# Altium schematic sheet NanoBoard.SchDoc
size A4
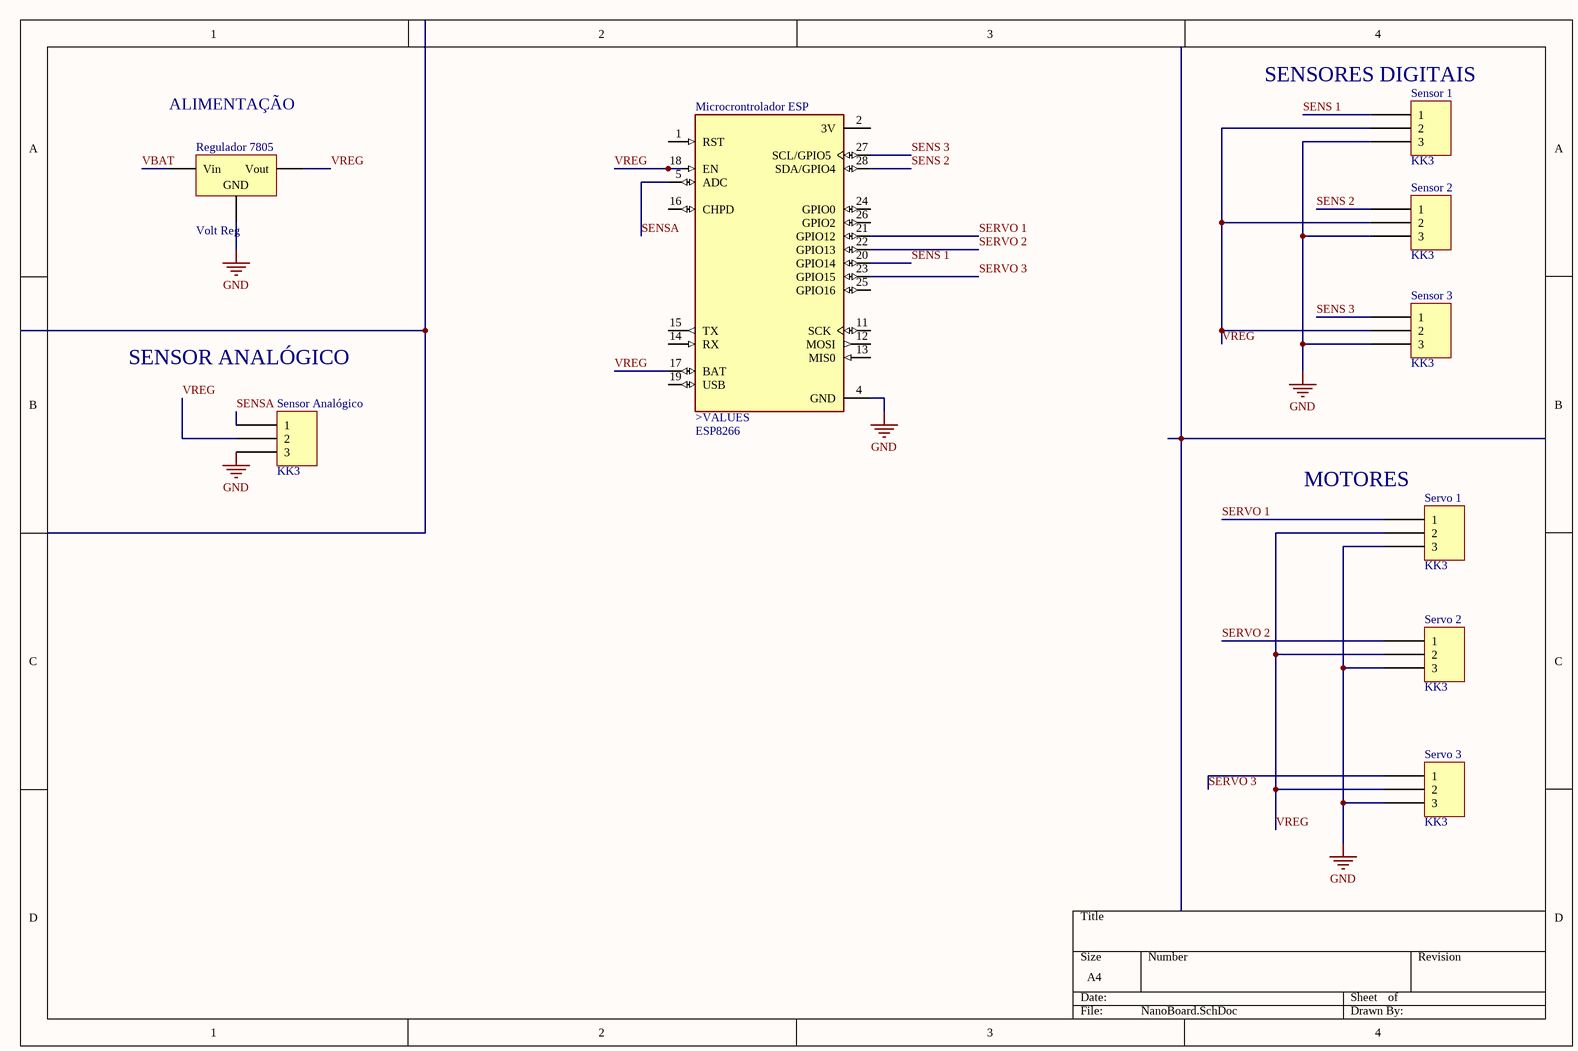
[diagram p0: NanoBoard.SchDoc]

## Parts
Microcrontrolador_ESP  ESP8266  [XCVR_ESP8266]
Regulador_7805  Volt Reg  [D2PAK_N]
Sensor_1  KK3  [KK3]
Sensor_2  KK3  [KK3]
Sensor_3  KK3  [KK3]
Sensor_Analógico  KK3  [KK3]
Servo_1  KK3  [KK3]
Servo_2  KK3  [KK3]
Servo_3  KK3  [KK3]

## Nets
GND: Microcrontrolador_ESP.4(GND) Regulador_7805.2(GND) Sensor_1.3 Sensor_2.3 Sensor_3.3 Sensor_Analógico.3 Servo_1.3 Servo_2.3 Servo_3.3
SENS 1: Microcrontrolador_ESP.20(GPIO14) Sensor_1.1
SENS 2: Microcrontrolador_ESP.28(SDA/GPIO4) Sensor_2.1
SENS 3: Microcrontrolador_ESP.27(SCL/GPIO5) Sensor_3.1
SENSA: Microcrontrolador_ESP.5(ADC) Sensor_Analógico.1
SERVO 1: Microcrontrolador_ESP.21(GPIO12) Servo_1.1
SERVO 2: Microcrontrolador_ESP.22(GPIO13) Servo_2.1
SERVO 3: Microcrontrolador_ESP.23(GPIO15) Servo_3.1
VBAT: Regulador_7805.1(Vin)
VREG: Microcrontrolador_ESP.17(BAT) Microcrontrolador_ESP.18(EN) Regulador_7805.3(Vout) Sensor_1.2 Sensor_2.2 Sensor_3.2 Sensor_Analógico.2 Servo_1.2 Servo_2.2 Servo_3.2

Not connected (* = marked no-connect by the designer): Microcrontrolador_ESP 1(RST) 2(3V) 11(SCK) 12(MOSI) 13(MIS0) 14(RX) 15(TX) 16(CHPD) 19(USB) 24(GPIO0) 25(GPIO16) 26(GPIO2)

## Notes on the sheet
- (near Sensor_1) SENSORES DIGITAIS
- ALIMENTAÇÃO
- SENSOR ANALÓGICO
- (near Servo_1) MOTORES
- (in symbol ESP8266) >VALUES

## Library data of the parts
Microcrontrolador_ESP = ESP8266: ESP8266, ESP-WROOM-02U series Transceiver; 802.11 b/g/n (Wi-Fi, WiFi, WLAN) Evaluation Board; MF: Espressif Systems; Value: *; SnapEDA_Link: https://www.snapeda.com/parts/ESP8266/Espressif+Systems/view-part/?ref=snap; MP: ESP8266; Purchase-URL: https://pricing.snapeda.com/search/part/ESP8266/?ref=eda; Check_prices: https://www.snapeda.com/parts/ESP8266/Espressif+Systems/view-part/?ref=eda; Availability: In Stock; Price: None; Package: None
Regulador_7805 = Volt Reg: Voltage Regulator; Published: 24-Mar-1999; LatestRevisionDate: 29-May-2009; LatestRevisionNote: IPC-7351 Footprint Added.; PackageReference: D2PAK; Publisher: Altium Limited; PackageDescription: 3-Pin Transistor Outline Package 2.54 mm Pitch, 15.1 mm Lead Span
Sensor_1-Sensor_3 Sensor_Analógico Servo_1-Servo_3 = KK3: KK Connector, 3 ways